# EAGLE design lcd-gps-tracker (EAGLE 7.4.0)
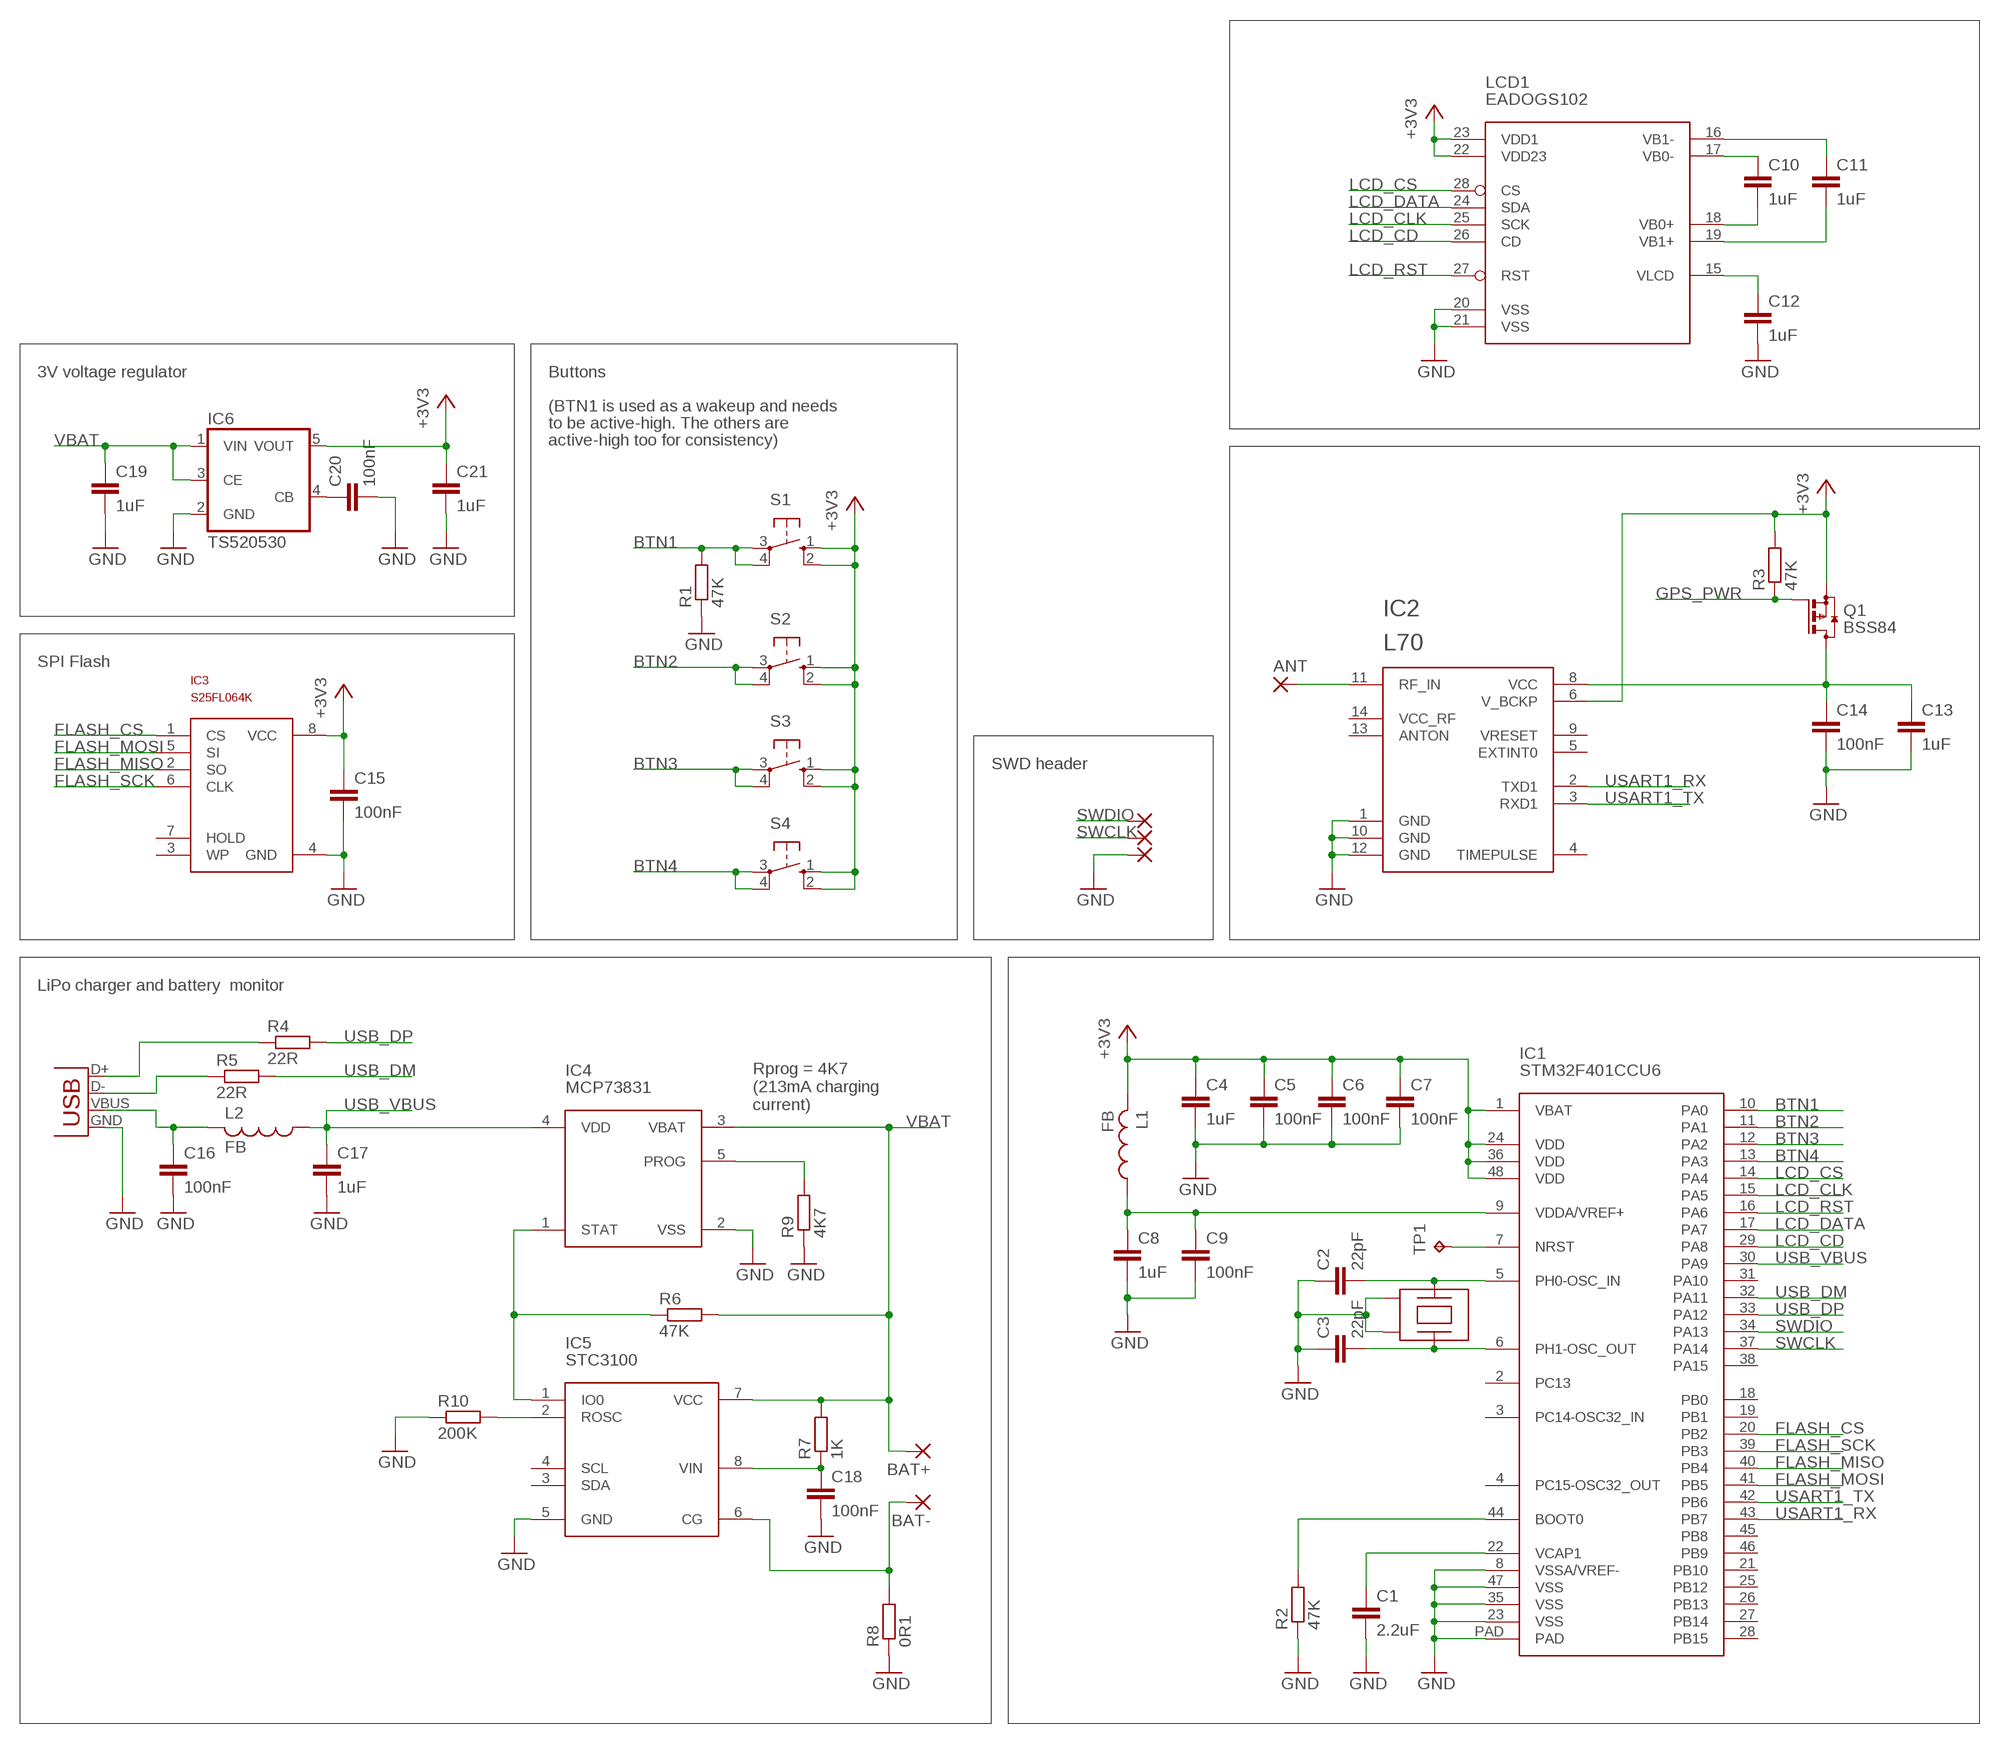
[diagram p0: schematic, sheet 1]

## Parts
ANT  2,54/1,0  [2,54/1,0]
BAT+  SMD2  [SMD1,27-2,54]
BAT-  SMD2  [SMD1,27-2,54]
C1  2.2uF  C-EUC0805  [C0805]
C2  22pF  C-EUC0603  [C0603]
C3  22pF  C-EUC0603  [C0603]
C4  1uF  C-EUC0603  [C0603]
C5  100nF  C-EUC0603  [C0603]
C6  100nF  C-EUC0603  [C0603]
C7  100nF  C-EUC0603  [C0603]
C8  1uF  C-EUC0603  [C0603]
C9  100nF  C-EUC0603  [C0603]
C10  1uF  C-EUC0603  [C0603]
C11  1uF  C-EUC0603  [C0603]
C12  1uF  C-EUC0603  [C0603]
C13  1uF  C-EUC0603  [C0603]
C14  100nF  C-EUC0603  [C0603]
C15  100nF  C-EUC0603  [C0603]
C16  100nF  C-EUC0603  [C0603]
C17  1uF  C-EUC0805  [C0805]
C18  100nF  C-EUC0603  [C0603]
C19  1uF  C-EUC0603  [C0603]
C20  100nF  C-EUC0603  [C0603]
C21  1uF  C-EUC0603  [C0603]
IC1  STM32F401CCU6  [UFQFPN48]
IC2  L70  [L70]
IC3  S25FL064K  [SO-08M]
IC4  MCP73831  [SOT23-5]
IC5  STC3100  [MSOP8]
IC6  TS520530  [SOT25]
L1  FB  L-USL2012C  [L2012C]
L2  FB  L-USL2012C  [L2012C]
LCD1  EADOGS102  [EADOGS]
Q1  BSS84  [SOT23]
R1  47K  R-EU_R0603  [R0603]
R2  47K  R-EU_R0603  [R0603]
R3  47K  R-EU_R0603  [R0603]
R4  22R  R-EU_R0603  [R0603]
R5  22R  R-EU_R0603  [R0603]
R6  47K  R-EU_R0603  [R0603]
R7  1K  R-EU_R0603  [R0603]
R8  0R1  R-EU_R0805  [R0805]
R9  4K7  R-EU_R0603  [R0603]
R10  200K  R-EU_R0603  [R0603]
S1  10-XX  [B3F-10XX]
S2  10-XX  [B3F-10XX]
S3  10-XX  [B3F-10XX]
S4  10-XX  [B3F-10XX]
SWCLK  SMD2  [SMD1,27-2,54]
SWDIO  SMD2  [SMD1,27-2,54]
SWGND  SMD2  [SMD1,27-2,54]
TP1  TPB1,27  [B1,27]
U$1  XTAL-7M  [XTAL_7M]
X1  USB-MICROB  [USB-MICROB]

## Nets
+3V3: C4.1 C5.1 C6.1 C7.1 C15.1 C21.1 IC1.1(VBAT) IC1.24(VDD) IC1.36(VDD) IC1.48(VDD) IC2.6(V_BCKP) IC3.8(VCC) IC6.5(VOUT) L1.2 LCD1.22(VDD23) LCD1.23(VDD1) Q1.2(S) R3.2 S1.1(S) S1.2(S1) S2.1(S) S2.2(S1) S3.1(S) S3.2(S1) S4.1(S) S4.2(S1)
BTN1: IC1.10(PA0) R1.2 S1.3(P) S1.4(P1)
BTN2: IC1.11(PA1) S2.3(P) S2.4(P1)
BTN3: IC1.12(PA2) S3.3(P) S3.4(P1)
BTN4: IC1.13(PA3) S4.3(P) S4.4(P1)
FLASH_CS: IC1.20(PB2) IC3.1(CS)
FLASH_MISO: IC1.40(PB4) IC3.2(SO)
FLASH_MOSI: IC1.41(PB5) IC3.5(SI)
FLASH_SCK: IC1.39(PB3) IC3.6(CLK)
GND: C1.2 C2.1 C3.1 C4.2 C5.2 C6.2 C7.2 C8.2 C9.2 C12.2 C13.2 C14.2 C15.2 C16.2 C17.2 C18.2 C19.2 C20.2 C21.2 IC1.8(VSSA/VREF-) IC1.23(VSS) IC1.35(VSS) IC1.47(VSS) IC1.PAD IC2.1(GND) IC2.10(GND) IC2.12(GND) IC3.4(GND) IC4.2(VSS) IC5.5(GND) IC6.2(GND) LCD1.20(VSS) LCD1.21(VSS) R1.1 R2.1 R8.1 R9.1 R10.1 SWGND.1(P) U$1.2(G1) U$1.4(G2) X1.GND
GPS_PWR: Q1.1(G) R3.1
LCD_CD: IC1.29(PA8) LCD1.26(CD)
LCD_CLK: IC1.15(PA5) LCD1.25(SCK)
LCD_CS: IC1.14(PA4) LCD1.28(CS)
LCD_DATA: IC1.17(PA7) LCD1.24(SDA)
LCD_RST: IC1.16(PA6) LCD1.27(RST)
N$1: C16.1 L2.2 X1.VBUS
N$2: R5.1 X1.D-
N$3: C1.1 IC1.22(VCAP1)
N$4: IC1.44(BOOT0) R2.2
N$5: C2.2 IC1.5(PH0-OSC_IN) U$1.1
N$6: C3.2 IC1.6(PH1-OSC_OUT) U$1.3
N$7: IC1.7(NRST) TP1.TP
N$8: C12.1 LCD1.15(VLCD)
N$9: C10.2 LCD1.18(VB0+)
N$10: C8.1 C9.1 IC1.9(VDDA/VREF+) L1.1
N$11: C10.1 LCD1.17(VB0-)
N$12: C11.1 LCD1.16(VB1-)
N$13: C11.2 LCD1.19(VB1+)
N$14: C13.1 C14.1 IC2.8(VCC) Q1.3(D)
N$15: ANT.1(P) IC2.11(RF_IN)
N$16: R4.1 X1.D+
N$17: IC4.1(STAT) IC5.1(IO0) R6.1
N$18: IC4.5(PROG) R9.2
N$19: C18.1 IC5.8(VIN) R7.1
N$21: BAT-.1(P) IC5.6(CG) R8.2
N$22: IC5.2(ROSC) R10.2
N$23: C20.1 IC6.4(CB)
SWCLK: IC1.37(PA14) SWCLK.1(P)
SWDIO: IC1.34(PA13) SWDIO.1(P)
USART1_RX: IC1.43(PB7) IC2.2(TXD1)
USART1_TX: IC1.42(PB6) IC2.3(RXD1)
USB_DM: IC1.32(PA11) R5.2
USB_DP: IC1.33(PA12) R4.2
USB_VBUS: C17.1 IC1.30(PA9) IC4.4(VDD) L2.1
VBAT: BAT+.1(P) C19.1 IC4.3(VBAT) IC5.7(VCC) IC6.1(VIN) IC6.3(CE) R6.2 R7.2
Unconnected: IC1.2(PC13) IC1.3(PC14-OSC32_IN) IC1.4(PC15-OSC32_OUT) IC1.18(PB0) IC1.19(PB1) IC1.21(PB10) IC1.25(PB12) IC1.26(PB13) IC1.27(PB14) IC1.28(PB15) IC1.31(PA10) IC1.38(PA15) IC1.45(PB8) IC1.46(PB9) IC2.4(TIMEPULSE) IC2.5(EXTINT0) IC2.9(VRESET) IC2.13(ANTON) IC2.14(VCC_RF) IC3.3(WP) IC3.7(HOLD) IC5.3(SDA) IC5.4(SCL)

## Notes on the sheet
- 3V voltage regulator | Buttons
- (BTN1 is used as a wakeup and needs
- to be active-high. The others are
- active-high too for consistency)
- SPI Flash
- SWD header
- LiPo charger and battery  monitor
- Rprog = 4K7
  (213mA charging
  current)

## Library data of the parts
ANT = wirepad:2,54/1,0: THROUGH-HOLE PAD
BAT+ BAT- SWCLK SWDIO SWGND = wirepad:SMD2: SMD PAD
C1-C21 = rcl:C-EU: CAPACITOR, European symbol
IC1 = qyx-misc:STM32F401CCU6
IC2 = qyx-misc:L70
IC3 = qyx-misc:S25FL064K
IC4 = qyx-misc:MCP73831
IC5 = stc3100:STC3100
IC6 = v-reg:TS5205: 150mA Low Noise LDO Voltage Regulator with Enable TSC [Taiwan Semiconductor Company, Ltd] Source: http://www.taiwansemi.com .. 5205_0409c.pdf
L1 L2 = rcl:L-US: INDUCTOR, American symbol
LCD1 = eadog:EADOGS102
Q1 = transistor-small-signal:BSS84: P-CHANNEL MOS FET
R1-R10 = rcl:R-EU_: RESISTOR, European symbol
S1-S4 = switch-omron:10-XX: OMRON SWITCH; MPN: B3F-1000; OC_FARNELL: 176432; OC_NEWARK: 36M3542
TP1 = testpad:TP: Test pad
U$1 = qyx-misc:XTAL-7M
X1 = SparkFun:USB: USB Connectors USB-B-PTH is fully proven SKU : PRT-00139 USB-miniB is fully proven SKU : PRT-00587 USB-A-PCB is untested. USB-A-H is throughly reviewed, but untested. Spark Fun Electronics SKU : PRT-00437 USB-B-SMT is throughly reviewed, but untested. Needs silkscreen touching up. USB-A-S has not been used/tested USB-MB-H has not been used/tested

## Board
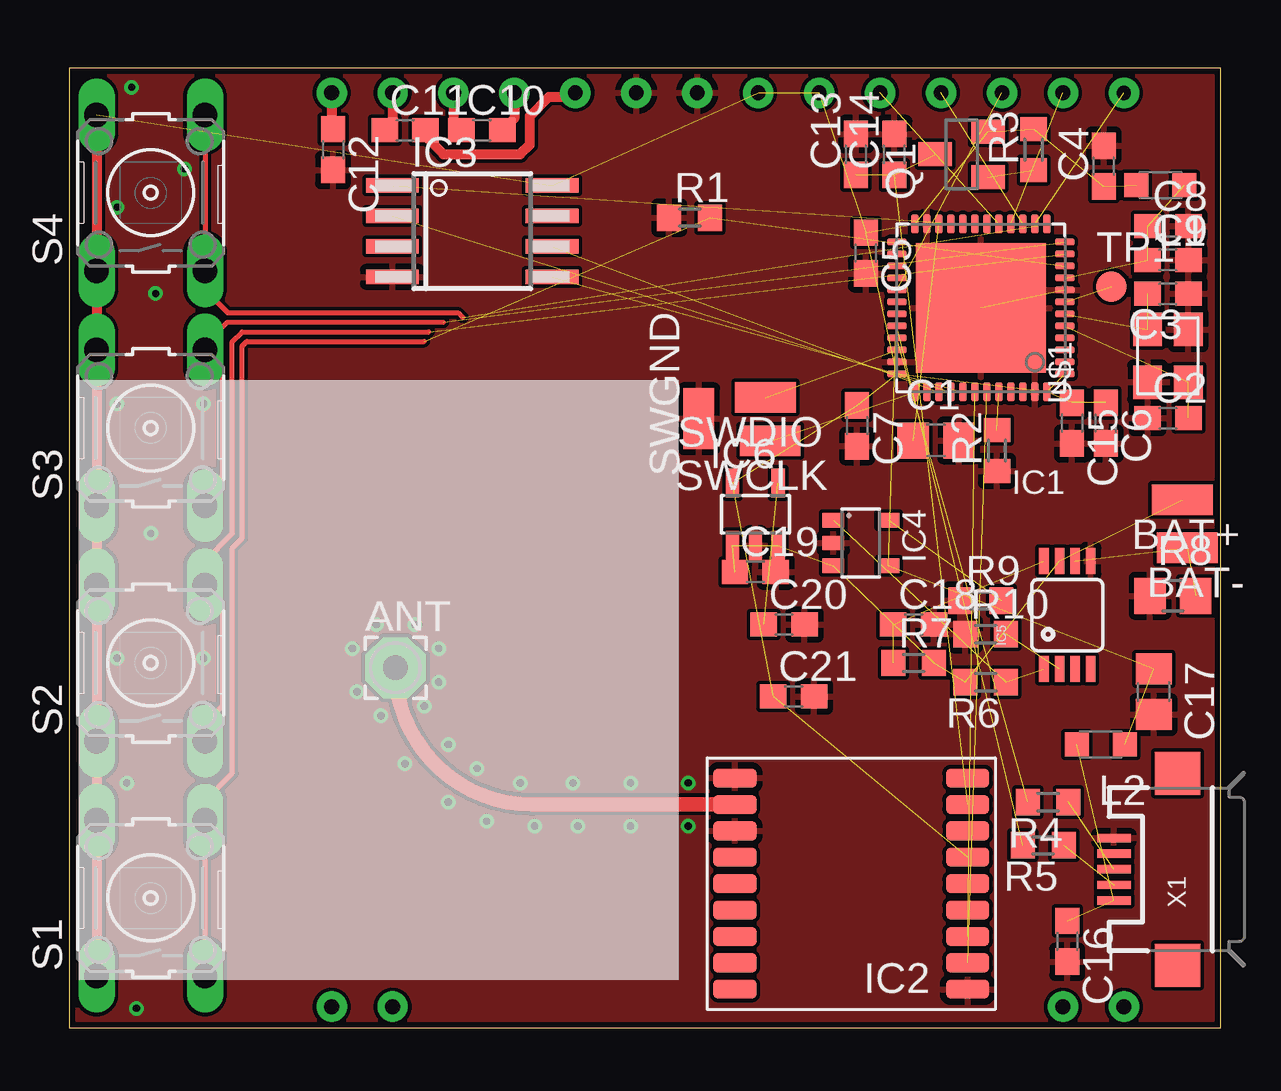
[diagram p1: board, top side]
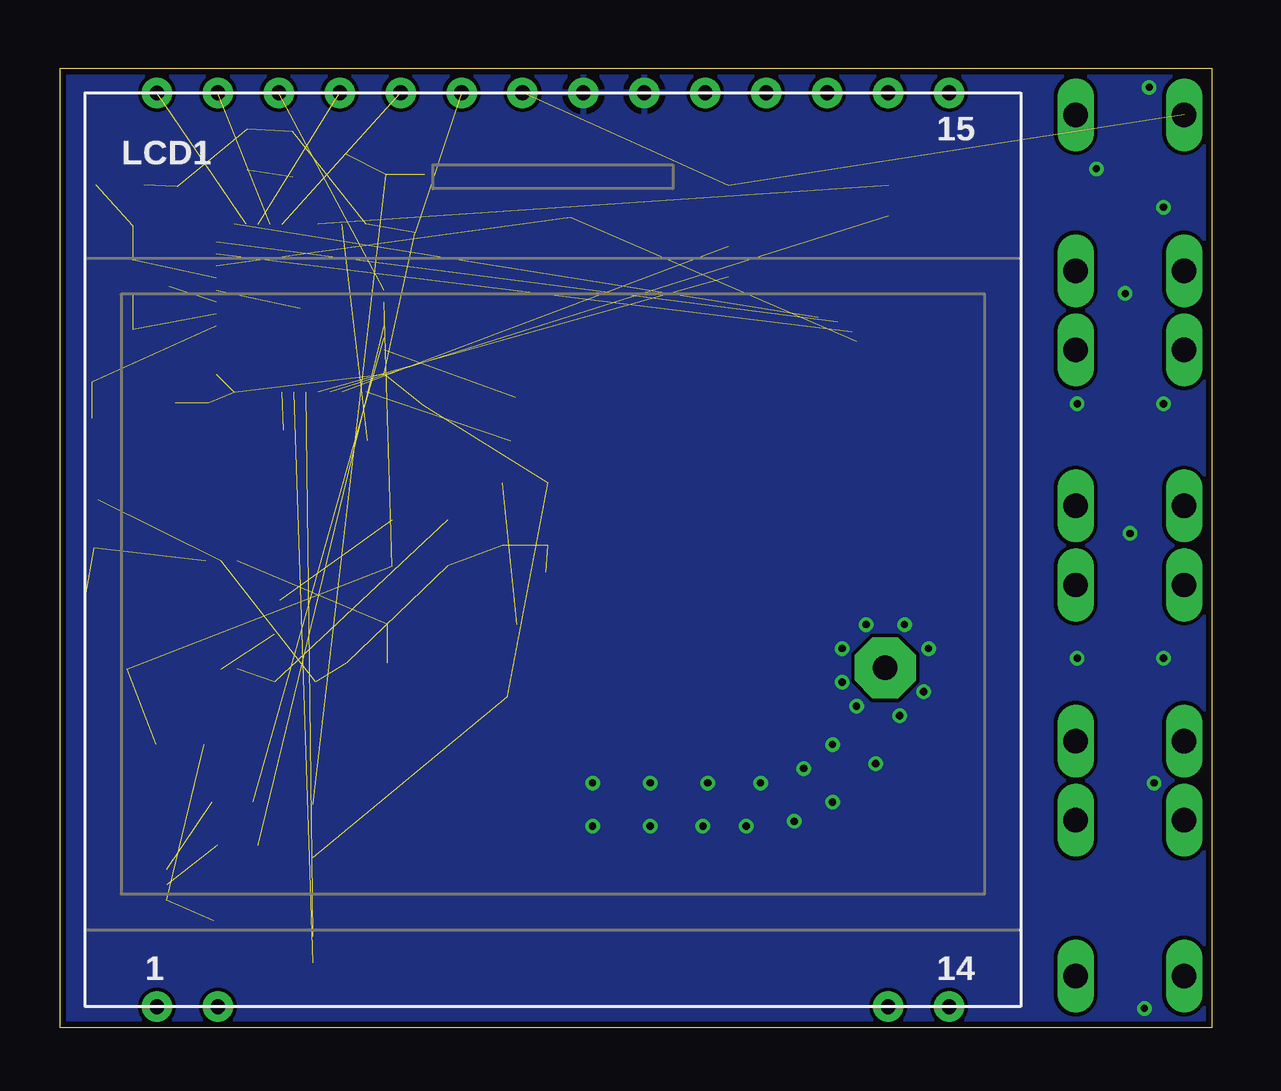
[diagram p2: board, bottom side, seen from below]

Size 48 x 40 mm. Coordinates in mm from the lower left corner, seen from the top.
Outline: 0,0 48,0 48,40 0,40 0,0
Copper layers (1*16): Top 0.035mm / dielectric 1.5mm / Bottom 0.035mm
Design rules "seeed": minimum track width 6mil, minimum drill 0.3mm, track to track 6mil, track to pad 6mil, pad to pad 6mil, via to via 6mil, smd to smd 0mil, copper to edge 10mil, drill to drill 10mil, minimum pad ring 6mil, minimum via ring 6mil, stop-mask expansion 2mil, vias tented up to drill 0.5mm, thermal gap 10mil

### Footprints (pad centres in the part's own frame; a part is rotated, then mirrored left to right if it is on the bottom)
2,54/1,0 = drill 1.016 pad 2.54 octagon: 1 0,0
SMD1,27-2,54 = smd 1.27 x 2.54: 1 0,0
C0805 = smd 1.3 x 1.5: 1 -0.95,0; 2 0.95,0
C0603 = smd 1.1 x 1: 1 -0.85,0; 2 0.85,0
UFQFPN48 = smd 0.8 x 0.3: 1 -3.5,2.75; 2 -3.5,2.25; 3 -3.5,1.75; 4 -3.5,1.25; 5 -3.5,0.75; 6 -3.5,0.25; 7 -3.5,-0.25; 8 -3.5,-0.75; 9 -3.5,-1.25; 10 -3.5,-1.75; 11 -3.5,-2.25; 12 -3.5,-2.75; 25 3.5,-2.75; 26 3.5,-2.25; 27 3.5,-1.75; 28 3.5,-1.25; 29 3.5,-0.75; 30 3.5,-0.25; 31 3.5,0.25; 32 3.5,0.75; 33 3.5,1.25; 34 3.5,1.75; 35 3.5,2.25; 36 3.5,2.75 | smd 0.3 x 0.8: 13 -2.75,-3.5; 14 -2.25,-3.5; 15 -1.75,-3.5; 16 -1.25,-3.5; 17 -0.75,-3.5; 18 -0.25,-3.5; 19 0.25,-3.5; 20 0.75,-3.5; 21 1.25,-3.5; 22 1.75,-3.5; 23 2.25,-3.5; 24 2.75,-3.5; 37 2.75,3.5; 38 2.25,3.5; 39 1.75,3.5; 40 1.25,3.5; 41 0.75,3.5; 42 0.25,3.5; 43 -0.25,3.5; 44 -0.75,3.5; 45 -1.25,3.5; 46 -1.75,3.5; 47 -2.25,3.5; 48 -2.75,3.5 | smd 5.4 x 5.4: PAD 0,0
L70 = smd 1.8 x 0.8: 1 -4.85,4.4; 2 -4.85,3.3; 3 -4.85,2.2; 4 -4.85,1.1; 5 -4.85,0; 6 -4.85,-1.1; 7 -4.85,-2.2; 8 -4.85,-3.3; 9 -4.85,-4.4; 10 4.85,-4.4; 11 4.85,-3.3; 12 4.85,-2.2; 13 4.85,-1.1; 14 4.85,0; 15 4.85,1.1; 16 4.85,2.2; 17 4.85,3.3; 18 4.85,4.4
SO-08M = smd 0.6 x 2.2: 1 -1.905,-3.33; 2 -0.635,-3.33; 3 0.635,-3.33; 4 1.905,-3.33; 5 1.905,3.33; 6 0.635,3.33; 7 -0.635,3.33; 8 -1.905,3.33
SOT23-5 = smd 0.6 x 0.9: 1 -0.95,-1.15; 2 0,-1.15; 3 0.95,-1.15; 4 0.95,1.15; 5 -0.95,1.15
MSOP8 = smd 0.4 x 1.1: 1 -0.975,-2.25; 2 -0.325,-2.25; 3 0.325,-2.25; 4 0.975,-2.25; 5 0.975,2.25; 6 0.325,2.25; 7 -0.325,2.25; 8 -0.975,2.25
SOT25 = smd 0.55 x 1.2: 1 -0.95,-1.3; 2 0,-1.3; 3 0.95,-1.3; 4 0.95,1.3; 5 -0.95,1.3
L2012C = smd 1 x 1: 1 -1,0; 2 1,0
EADOGS = drill 0.61 pad 1.27: 1 -16.51,-38.1; 2 -13.97,-38.1; 13 13.97,-38.1; 14 16.51,-38.1; 15 16.51,0; 16 13.97,0; 17 11.43,0; 18 8.89,0; 19 6.35,0; 20 3.81,0; 21 1.27,0; 22 -1.27,0; 23 -3.81,0; 24 -6.35,0; 25 -8.89,0; 26 -11.43,0; 27 -13.97,0 | drill 0.6 pad 1.27: 28 -16.51,0
SOT23 = smd 1 x 1.4: 1 -0.95,-1.1; 2 0.95,-1.1; 3 0,1.1
R0603 = smd 1 x 1.1: 1 -0.85,0; 2 0.85,0
R0805 = smd 1.3 x 1.5: 1 -0.95,0; 2 0.95,0
B3F-10XX = drill 1.016 long: 1 -3.251,2.261; 2 3.251,2.261; 3 -3.251,-2.261; 4 3.251,-2.261
B1,27 = smd 1.27 x 1.27: TP 0,0
XTAL_7M = smd 1.4 x 1.2: 1 -1.1,-0.85; 2 1.1,-0.85; 3 1.1,0.85; 4 -1.1,0.85
USB-MICROB = smd 0.35 x 1.4: D+ 0,2.65; D- -0.65,2.65; GND 1.3,2.65; ID 0.65,2.65; VBUS -1.3,2.65 | smd 1.8 x 1.9: MT1 -4,0; MT2 4,0

### Placement (x,y rotation side)
ANT  13.6,15 0 top
BAT+  46.4,22 90 top
BAT-  46.6,20 90 top
C1  36.13,24.48 0 top
C2  45.8,25.4 0 top
C3  45.8,30.6 180 top
C4  43.12,35.91 90 top
C5  33.2,32.29 270 top
C6  43.2,25.2 270 top
C7  32.84,25.09 270 top
C8  45.8,33.4 0 top
C9  45.8,32 0 top
C10  17.2,37.4 0 top
C11  14,37.4 0 top
C12  11,36.6 270 top
C13  32.8,36.4 90 top
C14  34.4,36.4 90 top
C15  41.8,25.2 270 top
C16  41.6,3.6 270 top
C17  45.2,14 270 top
C18  35.2,16.8 0 top
C19  28.6,19 0 top
C20  29.8,16.8 0 top
C21  30.2,13.8 0 top
IC1  38,30 180 top
IC2  32.6,6 180 top
IC3  16.8,33.2 270 top
IC4  33,20.2 270 top
IC5  41.6,17.2 0 top
IC6  28.6,21.4 0 top
L1  45.49,35.11 180 top
L2  43,11.8 180 top
LCD1  27.45,38.97 0 bottom
Q1  37.2,36.4 90 top
R1  25.86,33.76 0 top
R2  38.67,24.06 90 top
R3  40.2,36.6 90 top
R4  40.8,9.4 180 top
R5  40.6,7.6 180 top
R6  38.2,14.4 180 top
R7  35.2,15.2 0 top
R8  46,18 0 top
R9  38,17.8 0 top
R10  38.2,16.4 0 top
S1  3.4,5.4 90 top
S2  3.4,15.2 90 top
S3  3.4,25 90 top
S4  3.4,34.8 90 top
SWCLK  29.22,24.46 90 top
SWDIO  29.02,26.27 90 top
SWGND  26.25,25.38 0 top
TP1  43.44,30.89 0 top
U$1  45.8,28 90 top
X1  46.2,6.6 90 top

### Tracks (layer width: path | path; a pad name or v marks a point on that pad's centre or on a via)
+3V3  (18 unrouted)
  Top 0.406: S4.2 S4.1 S3.2 S3.1 S2.2 S2.1 S1.2 S1.1
BTN1  (2 unrouted)
  Top 0.2: S1.3 S1.4 5.66,9.46 6.8,10.6 6.8,20 7.2,20.4 7.2,28.4 7.4,28.6 14.8,28.6
BTN2  (1 unrouted)
  Top 0.2: 15,29 7.2,29 6.8,28.6 6.8,20.6 5.66,19.46 S2.4 6.4,17.71 6.4,13.4 5.66,12.66 S2.3
BTN3  (1 unrouted)
  Top 0.2: 15.6,29.4 6.6,29.4 5.66,28.46 S3.4 6.4,27.51 6.4,23 5.66,22.26 S3.3
BTN4  (1 unrouted)
  Top 0.2: S4.4 S4.3 5.66,30.74 6.6,29.8 16.2,29.8 16.4,29.6
FLASH_CS  (1 unrouted)
FLASH_MISO  (1 unrouted)
FLASH_MOSI  (1 unrouted)
FLASH_SCK  (1 unrouted)
GND  (via drill 0.3)  (1 unrouted)
  other vias: 25.8,8.4 23.4,8.4 21.2,8.4 19.4,8.4 17.4,8.6 15.8,9.4 14,11 13,13 14.8,13.4 15.8,11.8 17,10.8 18.8,10.2 21,10.2 23.4,10.2 25.8,10.2 12,14 11.8,15.8 12.8,16.8 14.4,16.8 15.4,15.8 15.4,14.4 2.8,0.8 2.4,10.2 5.6,15.4 2,15.4 3.4,20.6 2,26 5.6,26 3.6,30.6 2.6,39.2 4.8,35.8 2,34.2
  pour Top: 0,0 48,0 48,40 0,40
  pour Bottom: 0,0 48,0 48,40 0,40
GPS_PWR  (1 unrouted)
LCD_CD  (1 unrouted)
LCD_CLK  (1 unrouted)
LCD_CS  (1 unrouted)
LCD_DATA  (1 unrouted)
LCD_RST  (1 unrouted)
N$1  (2 unrouted)
N$2  (1 unrouted)
N$3  (1 unrouted)
N$4  (1 unrouted)
N$5  (2 unrouted)
N$6  (2 unrouted)
N$7  (1 unrouted)
N$8
  Top 0.406: LCD1.15 10.94,37.51 C12.1
N$9
  Top 0.406: LCD1.18 18.56,37.91 C10.2
N$10  (3 unrouted)
N$11
  Top 0.406: LCD1.17 16.02,37.73 C10.1
N$12
  Top 0.406: LCD1.16 13.48,37.73 C11.1
N$13
  Top 0.406: C11.2 14.85,37.15 15.6,36.4 18.8,36.4 19.2,36.8 19.2,38 20,38.8 20.93,38.8 LCD1.19
N$14  (3 unrouted)
N$15
  Top 0.61: IC2.11 19.3,9.3 arc-90 ANT.1
N$16  (1 unrouted)
N$17  (2 unrouted)
N$18  (1 unrouted)
N$19  (2 unrouted)
N$21  (2 unrouted)
N$22  (1 unrouted)
N$23  (1 unrouted)
SWCLK  (1 unrouted)
SWDIO  (1 unrouted)
USART1_RX  (1 unrouted)
USART1_TX  (1 unrouted)
USB_DM  (1 unrouted)
USB_DP  (1 unrouted)
USB_VBUS  (3 unrouted)
VBAT  (7 unrouted)